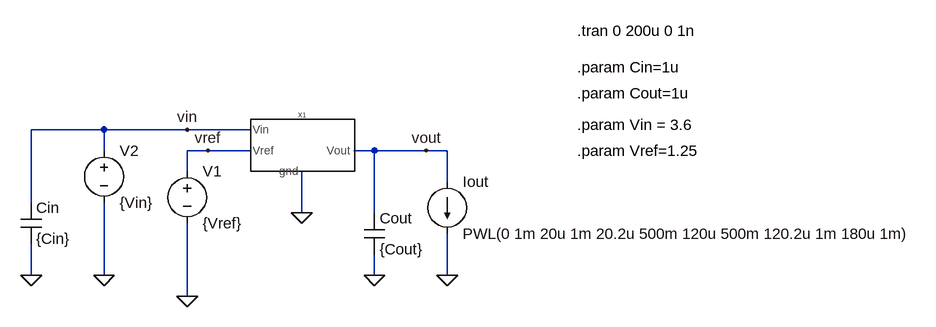
[diagram p0: schematic Load Transient_6p30.asc]
Load Transient_6p30.asc, the LTspice schematic file:
Version 4
SHEET 1 880 680
WIRE -448 64 -560 64
WIRE -320 64 -448 64
WIRE -224 64 -320 64
WIRE -448 96 -448 64
WIRE -288 96 -320 96
WIRE -224 96 -288 96
WIRE -32 96 -64 96
WIRE 48 96 -32 96
WIRE 80 96 48 96
WIRE -320 128 -320 96
WIRE 80 144 80 96
WIRE -560 176 -560 64
WIRE -144 192 -144 128
WIRE -32 192 -32 96
WIRE -560 288 -560 240
WIRE -448 288 -448 176
WIRE -32 288 -32 256
WIRE 80 288 80 224
WIRE -320 320 -320 208
FLAG -288 96 vref
FLAG -448 288 0
FLAG -320 64 vin
FLAG -32 288 0
FLAG 80 288 0
FLAG 48 96 vout
FLAG -144 192 0
FLAG -560 288 0
FLAG -320 320 0
SYMBOL LDO_basic -144 80 R0
SYMATTR InstName X1
SYMBOL voltage -320 112 R0
WINDOW 123 0 0 Left 0
WINDOW 39 0 0 Left 0
SYMATTR InstName V1
SYMATTR Value {Vref}
SYMBOL cap -48 192 R0
SYMATTR InstName Cout
SYMATTR Value {Cout}
SYMBOL current 80 144 R0
WINDOW 123 0 0 Left 0
WINDOW 39 0 0 Left 0
SYMATTR InstName Iout
SYMATTR Value PWL(0 1m 20u 1m 20.2u 500m 120u 500m 120.2u 1m 180u 1m)
SYMBOL voltage -448 80 R0
WINDOW 123 24 44 Left 2
WINDOW 39 0 0 Left 0
SYMATTR InstName V2
SYMATTR Value {Vin}
SYMBOL cap -576 176 R0
SYMATTR InstName Cin
SYMATTR Value {Cin}
TEXT 280 -88 Left 2 !.tran 0 200u 0 1n
TEXT 280 56 Left 2 !.param Vin = 3.6
TEXT 280 8 Left 2 !.param Cout=1u
TEXT 280 -32 Left 2 !.param Cin=1u
TEXT 280 96 Left 2 !.param Vref=1.25

The netlist it stands for:
* Load Transient_6p30.asc
XX1 vin vref 0 vout LDO_basic  ; pins Vin Vref gnd Vout
V1 vref 0 {Vref}
Cout vout 0 {Cout}
Iout vout 0 PWL(0 1m 20u 1m 20.2u 500m 120u 500m 120.2u 1m 180u 1m)
V2 vin 0 {Vin}
Cin vin 0 {Cin}
.tran 0 200u 0 1n
.param Vin = 3.6
.param Cout=1u
.param Cin=1u
.param Vref=1.25
.backanno
.end